# EAGLE design Adafruit GPIO Expander Bonnet Rev C (EAGLE 9.6.2)
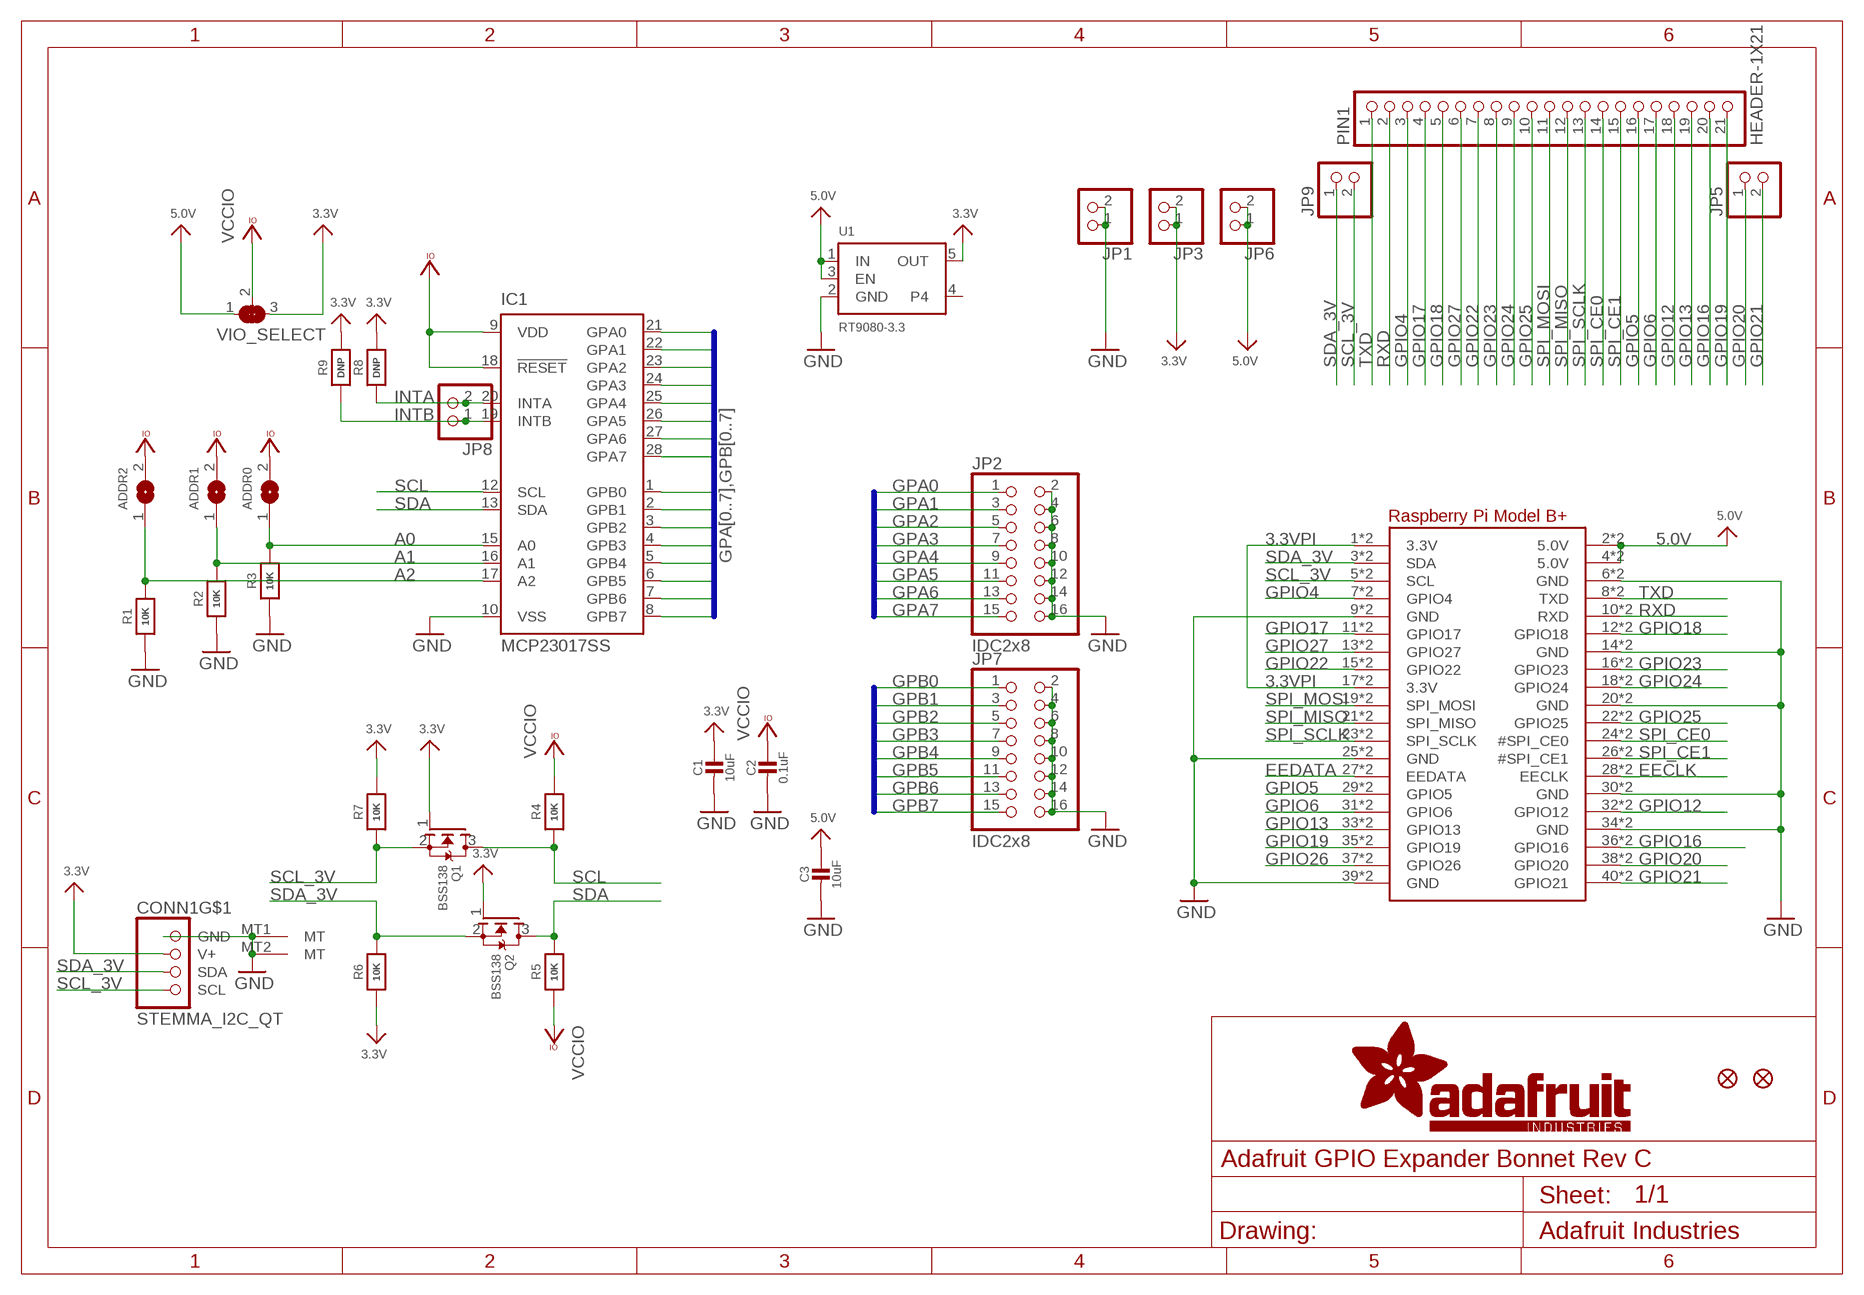
[diagram p0: schematic, sheet 1]

## Parts
ADDR0  SOLDERJUMPER  [SOLDERJUMPER_ARROW_NOPASTE]
ADDR1  SOLDERJUMPER  [SOLDERJUMPER_ARROW_NOPASTE]
ADDR2  SOLDERJUMPER  [SOLDERJUMPER_ARROW_NOPASTE]
C1  10uF  CAP_CERAMIC0805-NOOUTLINE  [0805-NO]
C2  0.1uF  CAP_CERAMIC0603_NO  [0603-NO]
C3  10uF  CAP_CERAMIC0805-NOOUTLINE  [0805-NO]
CONN1  STEMMA_I2C_QT  [JST_SH4]
FID1  FIDUCIAL_1MM  [FIDUCIAL_1MM]
FID2  FIDUCIAL_1MM  [FIDUCIAL_1MM]
IC1  MCP23017SS  [SSOP28]
JP1  HEADER-1X2ROUND  [1X02_ROUND]
JP2  IDC2x8  HEADER-2X8_SHROUDED  [2X08_SHROUDED]
JP3  HEADER-1X2ROUND  [1X02_ROUND]
JP5  HEADER-1X2ROUND  [1X02_ROUND]
JP6  HEADER-1X2ROUND  [1X02_ROUND]
JP7  IDC2x8  HEADER-2X8_SHROUDED  [2X08_SHROUDED]
JP8  HEADER-1X2ROUND  [1X02_ROUND]
JP9  HEADER-1X2ROUND  [1X02_ROUND]
PIN1  HEADER-1X21  [1X21_ROUND_70MIL]
Q1  BSS138  MOSFET-NWIDE  [SOT23-WIDE]
Q2  BSS138  MOSFET-NWIDE  [SOT23-WIDE]
R1  10K  RESISTOR_0603_NOOUT  [0603-NO]
R2  10K  RESISTOR_0603_NOOUT  [0603-NO]
R3  10K  RESISTOR_0603_NOOUT  [0603-NO]
R4  10K  RESISTOR_0603_NOOUT  [0603-NO]
R5  10K  RESISTOR_0603_NOOUT  [0603-NO]
R6  10K  RESISTOR_0603_NOOUT  [0603-NO]
R7  10K  RESISTOR_0603_NOOUT  [0603-NO]
R8  DNP  RESISTOR_0603_NOOUT  [0603-NO]
R9  DNP  RESISTOR_0603_NOOUT  [0603-NO]
RPI1  RASPBERRYPI_BPLUS_BONNET_THMSMT  [PI_BONNET_THMSMT]
U1  RT9080-3.3  VREG_SOT23-5  [SOT23-5]
VIO_SELECT  SOLDERJUMPER_2WAY  [SOLDERJUMPER_2WAY_OPEN_NOPASTE]

## Nets
3.3V: C1.1 CONN1.2(V+) JP3.1 JP3.2 Q1.1(G) Q2.1(G) R6.1 R7.2 R8.2 R9.2 U1.5(OUT) VIO_SELECT.3
3.3VPI: RPI1.1(3.3V) RPI1.17(3.3V) RPI1.S1(3.3V) RPI1.S17(3.3V)
5.0V: C3.1 JP6.1 JP6.2 RPI1.2(5.0V) RPI1.4(5.0V) RPI1.S2(5.0V) RPI1.S4(5.0V) U1.1(IN) U1.3(EN) VIO_SELECT.1
A0: ADDR0.1 IC1.15(A0) R3.2
A1: ADDR1.1 IC1.16(A1) R2.2
A2: ADDR2.1 IC1.17(A2) R1.2
EECLK: RPI1.28(EECLK) RPI1.S28(EECLK)
EEDATA: RPI1.27(EEDATA) RPI1.S27(EEDATA)
GND: C1.2 C2.2 C3.2 CONN1.1(GND) CONN1.MT1(MT) CONN1.MT2(MT) IC1.10(VSS) JP1.1 JP1.2 JP2.2 JP2.4 JP2.6 JP2.8 JP2.10 JP2.12 JP2.14 JP2.16 JP7.2 JP7.4 JP7.6 JP7.8 JP7.10 JP7.12 JP7.14 JP7.16 R1.1 R2.1 R3.1 RPI1.6(GND) RPI1.9(GND) RPI1.14(GND) RPI1.20(GND) RPI1.25(GND) RPI1.30(GND) RPI1.34(GND) RPI1.39(GND) RPI1.S6(GND) RPI1.S9(GND) RPI1.S14(GND) RPI1.S20(GND) RPI1.S25(GND) RPI1.S30(GND) RPI1.S34(GND) RPI1.S39(GND) U1.2(GND)
GPA0: IC1.21(GPA0) JP2.1
GPA1: IC1.22(GPA1) JP2.3
GPA2: IC1.23(GPA2) JP2.5
GPA3: IC1.24(GPA3) JP2.7
GPA4: IC1.25(GPA4) JP2.9
GPA5: IC1.26(GPA5) JP2.11
GPA6: IC1.27(GPA6) JP2.13
GPA7: IC1.28(GPA7) JP2.15
GPB0: IC1.1(GPB0) JP7.1
GPB1: IC1.2(GPB1) JP7.3
GPB2: IC1.3(GPB2) JP7.5
GPB3: IC1.4(GPB3) JP7.7
GPB4: IC1.5(GPB4) JP7.9
GPB5: IC1.6(GPB5) JP7.11
GPB6: IC1.7(GPB6) JP7.13
GPB7: IC1.8(GPB7) JP7.15
GPIO4: PIN1.3 RPI1.7(GPIO4) RPI1.S7(GPIO4)
GPIO5: PIN1.16 RPI1.29(GPIO5) RPI1.S29(GPIO5)
GPIO6: PIN1.17 RPI1.31(GPIO6) RPI1.S31(GPIO6)
GPIO12: PIN1.18 RPI1.32(GPIO12) RPI1.S32(GPIO12)
GPIO13: PIN1.19 RPI1.33(GPIO13) RPI1.S33(GPIO13)
GPIO16: PIN1.20 RPI1.36(GPIO16) RPI1.S36(GPIO16)
GPIO17: PIN1.4 RPI1.11(GPIO17) RPI1.S11(GPIO17)
GPIO18: PIN1.5 RPI1.12(GPIO18) RPI1.S12(GPIO18)
GPIO19: PIN1.21 RPI1.35(GPIO19) RPI1.S35(GPIO19)
GPIO20: JP5.1 RPI1.38(GPIO20) RPI1.S38(GPIO20)
GPIO21: JP5.2 RPI1.40(GPIO21) RPI1.S40(GPIO21)
GPIO22: PIN1.7 RPI1.15(GPIO22) RPI1.S15(GPIO22)
GPIO23: PIN1.8 RPI1.16(GPIO23) RPI1.S16(GPIO23)
GPIO24: PIN1.9 RPI1.18(GPIO24) RPI1.S18(GPIO24)
GPIO25: PIN1.10 RPI1.22(GPIO25) RPI1.S22(GPIO25)
GPIO26: RPI1.37(GPIO26) RPI1.S37(GPIO26)
GPIO27: PIN1.6 RPI1.13(GPIO27) RPI1.S13(GPIO27)
INTA: IC1.20(INTA) JP8.2 R8.1
INTB: IC1.19(INTB) JP8.1 R9.1
RXD: PIN1.2 RPI1.10(RXD) RPI1.S10(RXD)
SCL: IC1.12(SCL) Q1.3(D) R4.1
SCL_3V: CONN1.4(SCL) JP9.2 Q1.2(S) R7.1 RPI1.5(SCL) RPI1.S5(SCL)
SDA: IC1.13(SDA) Q2.3(D) R5.2
SDA_3V: CONN1.3(SDA) JP9.1 Q2.2(S) R6.2 RPI1.3(SDA) RPI1.S3(SDA)
SPI_CE0: PIN1.14 RPI1.24(#SPI_CE0) RPI1.S24(#SPI_CE0)
SPI_CE1: PIN1.15 RPI1.26(#SPI_CE1) RPI1.S26(#SPI_CE1)
SPI_MISO: PIN1.12 RPI1.21(SPI_MISO) RPI1.S21(SPI_MISO)
SPI_MOSI: PIN1.11 RPI1.19(SPI_MOSI) RPI1.S19(SPI_MOSI)
SPI_SCLK: PIN1.13 RPI1.23(SPI_SCLK) RPI1.S23(SPI_SCLK)
TXD: PIN1.1 RPI1.8(TXD) RPI1.S8(TXD)
VCCIO: ADDR0.2 ADDR1.2 ADDR2.2 C2.1 IC1.9(VDD) IC1.18(!RESET) R4.2 R5.1 VIO_SELECT.2
Unconnected: U1.4

## Buses
GPA[0..7],GPB[0..7]

## Library data of the parts
ADDR0 ADDR1 ADDR2 = microbuilder:SOLDERJUMPER: SMD Solder JUMPER Solder the two pads together to create a connection, or remove the solder to break it. REFLOW - Use this footprint for solder paste and reflow ovens. WAVE - Use this footprint for hand-soldering (larger pads). CLOSED - Has a trace between the two pads to ensure it is closed by default. The trace needs to be cut to disable the jumper, and can be closed again by creating a solder bridge between the two pads.; BOM: EXCLUDE
C1-C3 = microbuilder:CAP_CERAMIC: Ceramic Capacitors For new designs, use the packages preceded by an '_' character since they are more reliable: The following footprints should be used on most boards: _0402 - Standard footprint for regular board layouts _0603 - Standard footprint for regular board layouts _0805 - Standard footprint for regular board layouts _1206 - Standard footprint for regular board layouts For extremely tight-pitch boards where space is at a premium, the following 'micro-pitch' footprints can be used (smaller pads, no silkscreen outline, etc.): _0402MP - Micro-pitch footprint for very dense/compact boards _0603MP - Micro-pitch footprint for very dense/compact boards _0805MP - Micro-pitch footprint for very dense/compact boards _1206MP - Micro-pitch footprint for very dense/compact boards
CONN1 = adafruit_electromech:STEMMA_I2C; LCSC: C2845363
FID1 FID2 = microbuilder:FIDUCIAL: Fiducial Alignment Points Various fiducial points for machine vision alignment.; BOM: EXCLUDE
IC1 = microbuilder:MCP23017: http://ww1.microchip.com/downloads/en/DeviceDoc/21952a.pdf Source: http://ww1.microchip.com/downloads/en/DeviceDoc/21952a.pdf; MF: MICROCHIP; MPN: MCP23017-E/SS; OC_FARNELL: 1467674; OC_NEWARK: 31K2960
JP1 JP3 JP5 JP6 JP8 JP9 = microbuilder:HEADER-1X2: PIN HEADER
JP2 JP7 = microbuilder:HEADER-2X8
PIN1 = microbuilder:HEADER-1X21
Q1 Q2 = microbuilder:MOSFET-N: N-Channel Mosfet LEGEND VDS: Voltage Drain-Source ID: Drain Current RDS(ON): Drain-Source On-State Resistance VGS(TH): Gate-Source Threshold Voltage CISS: Drain-Source Input Capacitance SOT-23 Name VDS ID RDS(ON) VGS(TH) CISS Order Number 2N7002E 60V 260mA 2.5 Ohm 2.5V @ 250uA 26.7pF @ 25V 2N7002ET1GOSTR-ND BSH103 30V 850mA 400 mOhm 400mV @ 1mA 83pF @ 24V BSH103,235-ND BSS138 60V 320mA 1.6 Ohm 1.5V @ 250uA 50pF @ 10V Mouser: 771-BSS138PW115 DMN2075U-7 20V 4.2A 38 mOhm 1V @ 250 uA 594.3pF @ 10V DMN2075U-7DICT-ND * BSS138 good choice for I2C level-shifting POWERPAK 1212-8 Name VDS ID RDS(ON) VGS(TH) CISS Order Number Si7308DN 60V 6A 58 mOhm 3V @ 250uA 665pF @ 15V SI7308DN-T1-E3CT-ND
R1-R9 = microbuilder:RESISTOR: Resistors For new designs, use the packages preceded by an '_' character since they are more reliable: The following footprints should be used on most boards: _0402 - Standard footprint for regular board layouts _0603 - Standard footprint for regular board layouts _0805 - Standard footprint for regular board layouts _1206 - Standard footprint for regular board layouts For extremely tight-pitch boards where space is at a premium, the following 'micro-pitch' footprints can be used (smaller pads, no silkscreen outline, etc.): _0402MP - Micro-pitch footprint for very dense/compact boards _0603MP - Micro-pitch footprint for very dense/compact boards _0805MP - Micro-pitch footprint for very dense/compact boards _1206MP - Micro-pitch footprint for very dense/compact boards
RPI1 = adafruit_sbc:RASPBERRYPI_BPLUS
U1 = adafruit_power:VREG_SOT23-5: SOT23-5 Fixed Voltage Regulators Part Current Out V Out V In V Dropout θJA (°C/W) TJ (°C) Digikey Part No. ADP121 150mA 3.3V 3.4-5.5V 0.09V @ 150mA -- -- ADP121-AUJZ33R7CT-ND ADP121 150mA 3.0V 3.1-5.5V 0.09V @ 150mA -- -- ADP121-AUJZ30R7CT-ND ADP122 300mA 3.3V 3.4-5.5V 0.085V @ 300mA -- -- ADP122AUJZ-3.3-R7CT-ND ADP1712 300mA 3.3V 3.5-5.5V 0.17V @ 300mA -- -- ADP1712AUJZ-3.3-R7TR-ND AP7311 (Low Cost) 150mA 3.3V 3.5-6V 0.15V @ 150mA -- -- AP7311-33WG-7DICT-ND LD39015M18R 150mA 1.8V 1.9V-5.5V 0.08V @ 100mA -- -- 497-6977-1-ND LP2985A-33DBVR 150mA 3.3V 3.3-16V 0.28V @ 150mA 206 150 296-18479-1-ND MCP1824T-3302E/OT 300mA 3.3V 3.5V-6V 0.2V @ 300mA -- -- MCP1824T-3302E/OTCT-ND MIC5205-2.5YM5 TR 150mA 2.5V 2.7-16V 0.165V @ 150mA -- -- 576-1257-2-ND MIC5205-3.0YM5 TR 150mA 3.0V 3.2V-16V 0.165V @ 150mA -- -- 576-1258-2-ND MIC5205-3.3YM5 TR 150mA 3.3V 3.5V-16V 0.165V @ 150mA -- -- 576-1259-2-ND TPS780330220 150mA 3.3V+2.2V 3.6-5.5V 250mV Max -- -- 296-23332-1-ND TDA3663/N1,135 100mA 3.3V 3.5-45V 0.18V @ 50mA -- -- 568-5343-1-ND Max operating temp can be calculated using θJA, TJ (max junction temperature), and power in watts. Set the "Maximum Ambient Temperature" until it reaches TJ ("Max Junction Temperature"), which is the absolute limit for safe use of the regulator: Heat Sink Temperature Calculator <http://www.daycounter.com/Calculators/Heat-Sink-Temperature-Calculator.phtml> For example, With 12V source into a 3.3V LP2985 and a 30mA load, we are dissipating (12V-3.3V) * 0.03A = 0.261W. With a θJA of 206 °C/W, a TJ of 150°C, and 261mW we can safely use the chip without a heat sink up to 75°C (=147.1°C Junction Temperature).; JLC_ROTATION: 0
VIO_SELECT = microbuilder:SOLDERJUMPER_2WAY: 2-Way Solder Jumper

## Board
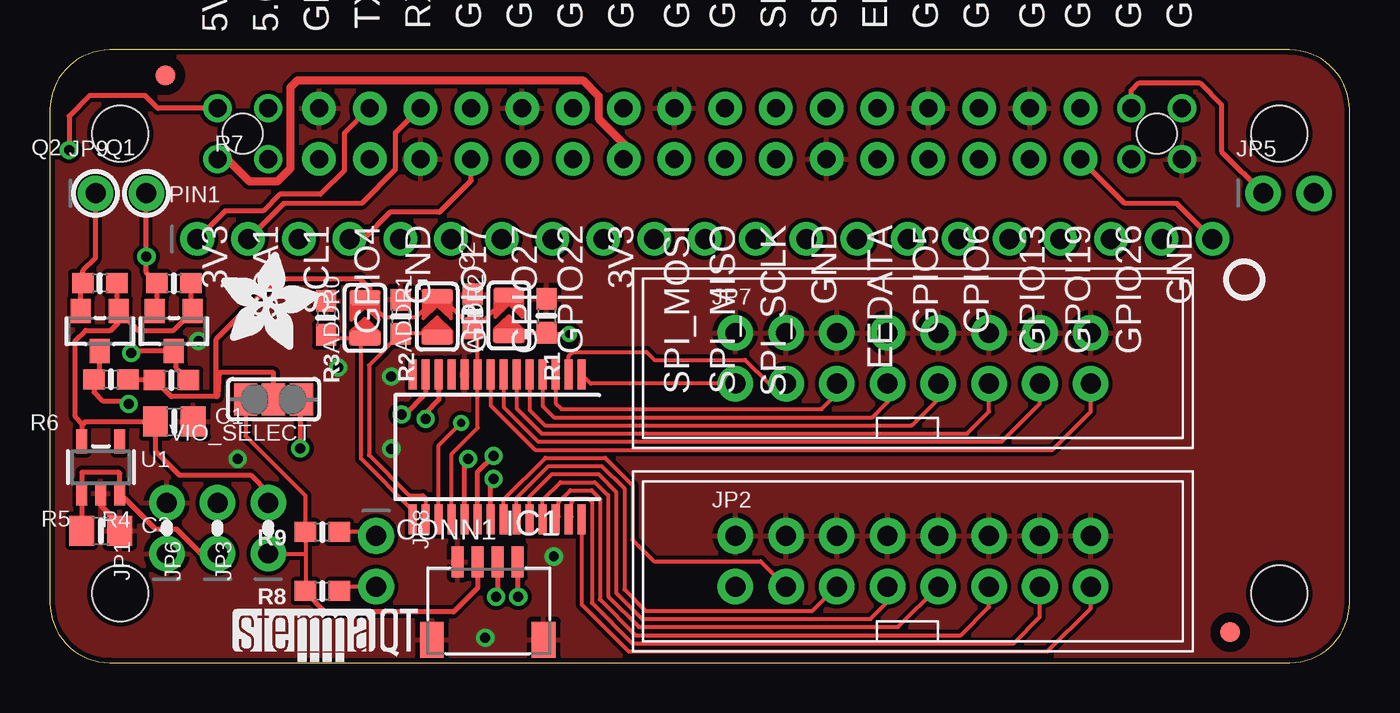
[diagram p1: board, top side]
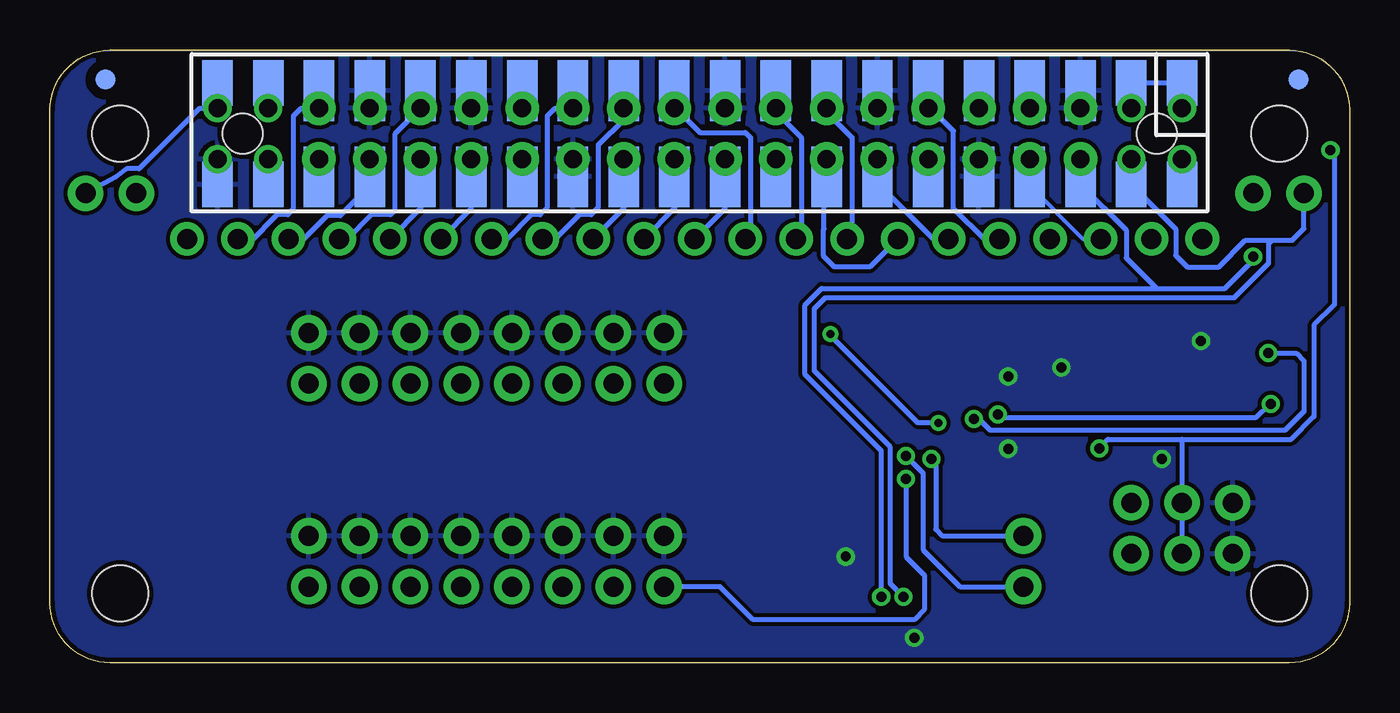
[diagram p2: board, bottom side, seen from below]

Size 65.02 x 30.67 mm. Coordinates in mm from the lower left corner, seen from the top.
Outline: 0,27.67 0,3 arc90 3,0 62.02,0 arc90 65.02,3 65.02,27.67 arc90 62.02,30.67 3,30.67 arc90 0,27.67
Copper layers (1*16): Top 0.035mm / dielectric 1.5mm / Bottom 0.035mm
Design rules "adafruit *": minimum track width 8mil, minimum drill 15.5mil, track to track 8mil, track to pad 8mil, pad to pad 8mil, via to via 8mil, smd to smd 8mil, copper to edge 10mil, drill to drill 8mil, minimum pad ring 10mil, minimum via ring 8mil, stop-mask expansion 2mil, vias tented up to drill 20mil, thermal gap 10mil

### Footprints (pad centres in the part's own frame; a part is rotated, then mirrored left to right if it is on the bottom)
SOLDERJUMPER_ARROW_NOPASTE = smd 0.762 x 1.524: 1 -1.016,0; 2 1.016,0
0805-NO = smd 1.24 x 1.5: 1 -0.95,0; 2 0.95,0
0603-NO = smd 1.075 x 1: 1 -0.85,0; 2 0.85,0
JST_SH4 = smd 0.6 x 1.55: 1 -1.5,2.006; 2 -0.5,2.006; 3 0.5,2.006; 4 1.5,2.006 | smd 1.2 x 1.8: MT1 -2.8,-1.894; MT2 2.8,-1.894
FIDUCIAL_1MM = smd 1 x 1: 1 0,0
SSOP28 = smd 0.4 x 1.5: 1 -4.225,-3.625; 2 -3.575,-3.625; 3 -2.925,-3.625; 4 -2.275,-3.625; 5 -1.625,-3.625; 6 -0.975,-3.625; 7 -0.325,-3.625; 8 0.325,-3.625; 9 0.975,-3.625; 10 1.625,-3.625; 11 2.275,-3.625; 12 2.925,-3.625; 13 3.575,-3.625; 14 4.225,-3.625; 15 4.225,3.625; 16 3.575,3.625; 17 2.925,3.625; 18 2.275,3.625; 19 1.625,3.625; 20 0.975,3.625; 21 0.325,3.625; 22 -0.325,3.625; 23 -0.975,3.625; 24 -1.625,3.625; 25 -2.275,3.625; 26 -2.925,3.625; 27 -3.575,3.625; 28 -4.225,3.625
1X02_ROUND = drill 1 pad 1.778: 1 -1.27,0; 2 1.27,0
2X08_SHROUDED = drill 1 pad 1.778: 1 -8.89,-1.27; 2 -8.89,1.27; 3 -6.35,-1.27; 4 -6.35,1.27; 5 -3.81,-1.27; 6 -3.81,1.27; 7 -1.27,-1.27; 8 -1.27,1.27; 9 1.27,-1.27; 10 1.27,1.27; 11 3.81,-1.27; 12 3.81,1.27; 13 6.35,-1.27; 14 6.35,1.27; 15 8.89,-1.27; 16 8.89,1.27
1X21_ROUND_70MIL = drill 1 pad 1.676: 1 -25.4,0; 2 -22.86,0; 3 -20.32,0; 4 -17.78,0; 5 -15.24,0; 6 -12.7,0; 7 -10.16,0; 8 -7.62,0; 9 -5.08,0; 10 -2.54,0; 11 0,0; 12 2.54,0; 13 5.08,0; 14 7.62,0; 15 10.16,0; 16 12.7,0; 17 15.24,0; 18 17.78,0; 19 20.32,0; 20 22.86,0; 21 25.4,0
SOT23-WIDE = smd 1 x 1.2: 1 -0.95,-1; 2 0.95,-1; 3 0,1
PI_BONNET_THMSMT = drill 0.9 pad 1.27: 1 -24.13,-1.27; 2 -24.13,1.27; 3 -21.59,-1.27; 4 -21.59,1.27; 37 21.59,-1.27; 38 21.59,1.27; 39 24.13,-1.27; 40 24.13,1.27 | drill 0.9 pad 1.676: 5 -19.05,-1.27; 6 -19.05,1.27; 7 -16.51,-1.27; 8 -16.51,1.27; 9 -13.97,-1.27; 10 -13.97,1.27; 11 -11.43,-1.27; 12 -11.43,1.27; 13 -8.89,-1.27; 14 -8.89,1.27; 15 -6.35,-1.27; 16 -6.35,1.27; 17 -3.81,-1.27; 18 -3.81,1.27; 19 -1.27,-1.27; 20 -1.27,1.27; 21 1.27,-1.27; 22 1.27,1.27; 23 3.81,-1.27; 24 3.81,1.27; 25 6.35,-1.27; 26 6.35,1.27; 27 8.89,-1.27; 28 8.89,1.27; 29 11.43,-1.27; 30 11.43,1.27; 31 13.97,-1.27; 32 13.97,1.27; 33 16.51,-1.27; 34 16.51,1.27; 35 19.05,-1.27; 36 19.05,1.27 | smd 1 x 1 bottom: 41 -29.96,2.71; 42 29.73,2.71 | smd 1.524 x 2.286 bottom: S1 -24.13,-2.542; S2 -24.13,2.538; S3 -21.59,-2.542; S4 -21.59,2.538; S37 21.59,-2.542; S38 21.59,2.538; S39 24.13,-2.542; S40 24.13,2.538 | smd 1.524 x 2.54 bottom: S5 -19.05,-2.415 | smd 1.524 x 3.048 bottom: S6 -19.05,2.157; S7 -16.51,-2.161; S8 -16.51,2.157; S9 -13.97,-2.161; S10 -13.97,2.157; S11 -11.43,-2.161; S12 -11.43,2.157; S13 -8.89,-2.161; S14 -8.89,2.157; S15 -6.35,-2.161; S16 -6.35,2.157; S17 -3.81,-2.161; S18 -3.81,2.157; S19 -1.27,-2.161; S20 -1.27,2.157; S21 1.27,-2.161; S22 1.27,2.157; S23 3.81,-2.161; S24 3.81,2.157; S25 6.35,-2.161; S26 6.35,2.157; S27 8.89,-2.161; S28 8.89,2.157; S29 11.43,-2.161; S30 11.43,2.157; S31 13.97,-2.161; S32 13.97,2.157; S33 16.51,-2.161; S34 16.51,2.157; S35 19.05,-2.161; S36 19.05,2.157 | hole 2.8: -29,0; 29,0; 29,-23; -29,-23 | hole 2: -22.86,0; 22.86,0
SOT23-5 = smd 0.55 x 1.2: 1 -0.95,-1.3; 2 0,-1.3; 3 0.95,-1.3; 4 0.95,1.3; 5 -0.95,1.3
SOLDERJUMPER_2WAY_OPEN_NOPASTE = smd 1.168 x 1.6: 1 -1.397,0; 2 0,0; 3 1.397,0

### Placement (x,y rotation side)
ADDR0  15.77,17.25 90 top
ADDR1  19.38,17.32 90 top
ADDR2  22.96,17.38 90 top
C1  6.22,12.06 0 top
C2  21.15,17.59 90 top
C3  2.54,6.6 0 top
CONN1  21.91,3.05 0 top
FID1  5.78,29.4 0 top
FID2  59.05,1.52 0 top
IC1  22.38,10.79 180 top
JP1  5.84,6.73 90 top
JP2  43.18,5.08 0 top
JP3  10.92,6.73 90 top
JP5  61.98,23.5 0 top
JP6  8.38,6.73 90 top
JP7  43.18,15.24 0 top
JP8  16.32,5.08 270 top
JP9  3.56,23.5 0 top
PIN1  32.77,21.21 0 top
PLABEL0  [PLABEL0]  5.84,9.65 0 top
PLABEL1  [PLABEL1]  8.38,9.65 0 top
PLABEL2  [PLABEL2]  11.05,9.59 0 top
PLABEL3  [PLABEL3]  2.13,21.54 0 top
PLABEL4  [PLABEL4]  5.16,21.46 0 top
PLABEL5  [PLABEL5]  7.37,22.86 0 top
PLABEL6  [PLABEL6]  9.91,22.86 0 top
PLABEL7  [PLABEL7]  12.45,22.86 0 top
PLABEL8  [PLABEL8]  14.99,22.86 0 top
PLABEL9  [PLABEL9]  17.53,22.86 0 top
PLABEL10  [PLABEL10]  20.07,22.86 0 top
PLABEL11  [PLABEL11]  22.61,22.86 0 top
PLABEL12  [PLABEL12]  25.15,22.86 0 top
PLABEL13  [PLABEL13]  27.69,22.86 0 top
PLABEL14  [PLABEL14]  30.23,22.86 0 top
PLABEL15  [PLABEL15]  32.77,22.86 0 top
PLABEL16  [PLABEL16]  35.31,22.86 0 top
PLABEL17  [PLABEL17]  37.85,22.86 0 top
PLABEL18  [PLABEL18]  40.39,22.86 0 top
PLABEL19  [PLABEL19]  42.93,22.86 0 top
PLABEL20  [PLABEL20]  45.47,22.86 0 top
PLABEL21  [PLABEL21]  48.01,22.86 0 top
PLABEL22  [PLABEL22]  50.55,22.86 0 top
PLABEL23  [PLABEL23]  53.09,22.86 0 top
PLABEL24  [PLABEL24]  55.63,22.86 0 top
PLABEL25  [PLABEL25]  58.17,22.86 0 top
PLABEL26  [PLABEL26]  60.71,21.72 0 top
PLABEL27  [PLABEL27]  63.25,21.72 0 top
PLABEL28  [PLABEL28]  23.05,19.68 0 top
PLABEL29  [PLABEL29]  19.49,19.68 0 top
PLABEL30  [PLABEL30]  15.62,19.68 0 top
PLABEL31  [PLABEL31]  11.3,15.05 0 top
PLABEL32  [PLABEL32]  12.7,11.37 0 top
PLABEL33  [PLABEL33]  13.84,5.21 0 top
PLABEL34  [PLABEL34]  13.84,8 0 top
PLABEL35  [PLABEL35]  59.18,16.76 0 top
PLABEL36  [PLABEL36]  59.31,6.6 0 top
PLABEL37  [PLABEL37]  28.26,7.37 90 top
PLABEL38  [PLABEL38]  28.19,17.65 90 top
PLABEL39  [PLABEL39]  28.19,12.89 90 top
PLABEL40  [PLABEL40]  28.19,2.79 90 top
PLABEL41  [PLABEL41]  58.67,3.68 0 top
PLABEL42  [PLABEL42]  58.67,13.97 0 top
PLABEL43  [PLABEL43]  52.07,12.19 0 top
PLABEL44  [PLABEL44]  46.99,12.19 0 top
PLABEL45  [PLABEL45]  49.53,12.19 0 top
PLABEL46  [PLABEL46]  44.45,12.19 0 top
PLABEL47  [PLABEL47]  41.91,12.19 0 top
PLABEL48  [PLABEL48]  39.37,12.19 0 top
PLABEL49  [PLABEL49]  36.83,12.19 0 top
PLABEL50  [PLABEL50]  34.29,12.19 0 top
PLABEL51  [PLABEL51]  52.07,2.03 0 top
PLABEL52  [PLABEL52]  46.99,2.03 0 top
PLABEL53  [PLABEL53]  49.53,2.03 0 top
PLABEL54  [PLABEL54]  44.45,2.03 0 top
PLABEL55  [PLABEL55]  41.91,2.03 0 top
PLABEL56  [PLABEL56]  39.37,2.03 0 top
PLABEL57  [PLABEL57]  36.83,2.03 0 top
PLABEL58  [PLABEL58]  34.29,2.03 0 top
PLABEL59  [PLABEL59]  31.62,4.95 0 top
PLABEL60  [PLABEL60]  31.62,15.49 0 top
PLABEL61  [PLABEL61]  63.94,13.02 90 top
PLABEL62  [PLABEL62]  62.29,12.76 90 top
PLABEL63  [PLABEL63]  9.78,11.43 0 top
Q1  6.2,16.6 180 top
Q2  2.5,16.6 180 top
R1  24.84,17.35 270 top
R2  17.55,17.32 270 top
R3  13.81,17.25 270 top
R4  6.09,14.15 180 top
R5  3.06,14.18 180 top
R6  2.5,19 180 top
R7  6.2,19 0 top
R8  13.63,3.59 180 top
R9  13.63,6.54 180 top
RPI1  32.51,26.48 0 top
U1  2.54,9.78 0 top
U$12  [ADAFRUIT_5MM]  8.57,15.68 0 top
U$13  [PCBFEAT-REV-040]  59.75,19.18 90 top
U$19  [STEMMAQT]  9.14,0.06 0 top
VIO_SELECT  11.19,13.19 180 top

### Tracks (layer width: path | path; a pad name or v marks a point on that pad's centre or on a via)
3.3V
  Top 0.203: JP3.1 12.78,5.46 R8.2 R9.2 12.78,8.35 9.79,11.35 VIO_SELECT.3
  Top 0.254: R6.1 3.35,17.7 3.41,17.64 | 3.41,17.64 Q2.1 4.41,16.64 6.19,16.64 Q1.1 7.05,17.7 R7.2 | JP3.1 JP3.2 10.92,8.51 10.03,9.4 6.48,9.4 5.27,10.6 C1.1 1.78,12.06 1.65,11.94 | 1.65,11.94 1.27,12.32 1.27,16.13 1.78,16.64 3.05,16.64 3.41,17 3.41,17.64 | U1.5 1.59,11.88 1.65,11.94 | CONN1.2 21.41,3.75 20.19,2.54 13.78,2.54 12.78,3.54 R8.2
3.3VPI
  Top 0.406: RPI1.1 8.86,25.21 9.97,24.1 11.38,24.1 12.03,24.75 12.03,28.8 12.38,29.15 26.67,29.15 27.46,28.36 27.46,27.23 28.7,25.99 RPI1.17
  Bottom 0.254: RPI1.S17 RPI1.17 | RPI1.17 | RPI1.S1 RPI1.1 | RPI1.1
5.0V  (via drill 0.5)
  Top 0.254: C3.1 U1.1 1.59,9.53 3.43,9.53 3.49,9.46 U1.3 5.29,6.68 6.35,6.68 7.57,5.46 JP6.1 | RPI1.2 5.4,27.75 4.76,28.38 1.97,28.38 0.95,27.37 v0.95,25.65 | VIO_SELECT.1 12.53,13.13 v12.53,10.73
  Bottom 0.254: 8.38,11.18 JP6.2 JP6.1 | 8.38,11.18 2.92,11.18 1.78,12.32 1.78,16.89 0.76,17.91 0.76,25.46 v0.95,25.65 | RPI1.2 | RPI1.4 RPI1.S4 RPI1.S2 RPI1.2 | RPI1.4 | v12.53,10.73 12.08,11.18 8.38,11.18
A0
  Top 0.203: ADDR0.1 15.56,16.24 | 15.56,16.24 13.98,16.24 R3.2 | IC1.15 18.16,7.62 15.56,10.22 15.56,16.24
A1
  Top 0.203: ADDR1.1 19.21,16.47 R2.2 15.96,14.88 15.96,10.39 17.97,8.38 18.67,8.38 18.8,8.24 IC1.16
A2  (via drill 0.39)
  Top 0.203: IC1.17 19.46,10.88 v20.57,12 | v25.97,16.45 24.9,16.45 R1.2 23.1,16.5 ADDR2.1
  Bottom 0.203: 25.97,16.38 v25.97,16.45
  Bottom 0.254: v20.57,12 21.59,12 25.97,16.38
EECLK
  Bottom 0.254: RPI1.S28 | RPI1.S28 RPI1.28
EEDATA
  Bottom 0.254: RPI1.S27 RPI1.27 | RPI1.27
GND  (via drill 0.5)
  Top 0.254: U1.2 2.54,7.87 3.49,6.92 C3.2
  other vias: 7.43,16.11 14.41,14.77 9.4,10.2 17.08,10.71 17.08,14.33 21.78,1.25 25.21,5.31
  pour Bottom: 0,30.99 64.77,30.99 64.77,0 0,0
  pour Top: 0,30.99 64.77,30.99 64.77,0 0,0
GPA0  (via drill 0.5)
  Top 0.254: IC1.21 22.05,9.07 v22.19,9.21
  Bottom 0.254: v22.19,9.21 22.19,5.3 21.27,4.38 21.27,2.67 21.78,2.16 29.84,2.16 31.5,3.81 JP2.1
GPA1
  Top 0.203: IC1.22 22.71,8.17 24.79,10.25 27.77,10.25 29.14,8.88 29.14,6.16 30.22,5.08 35.56,5.08 JP2.3
GPA2
  Top 0.203: IC1.23 23.36,8.25 24.96,9.85 27.61,9.85 28.74,8.72 28.74,3.67 29.8,2.6 38.16,2.6 JP2.5
GPA3
  Top 0.203: IC1.24 24.01,8.32 25.12,9.44 27.44,9.44 28.33,8.55 28.33,3.5 29.63,2.2 41.06,2.2 41.91,3.05 JP2.7
GPA4
  Top 0.203: IC1.25 24.66,8.15 25.54,9.03 27.27,9.03 27.92,8.38 27.92,3.33 29.46,1.79 42.43,1.79 JP2.9
GPA5
  Top 0.203: IC1.26 25.45,7.31 25.45,8.04 26.04,8.63 27.1,8.63 27.52,8.21 27.52,3.16 29.29,1.38 45.58,1.38 46.99,2.79 JP2.11
GPA6
  Top 0.203: IC1.27 26.1,7.31 26.1,8.04 26.28,8.22 26.93,8.22 27.11,8.04 27.11,2.99 29.12,0.98 48.22,0.98 49.53,2.29 JP2.13
GPA7
  Top 0.203: IC1.28 26.61,2.92 28.96,0.57 49.91,0.57 52.07,2.73 JP2.15
GPB0
  Top 0.203: JP7.1 27.05,13.97 IC1.1
GPB1
  Top 0.203: IC1.2 25.96,15.35 26.16,15.56 29.84,15.56 30.24,15.16 34.78,15.16 35.98,13.97 JP7.3
GPB2
  Top 0.203: IC1.3 25.3,12.98 25.59,12.69 38.61,12.69 39.37,13.45 JP7.5
GPB3
  Top 0.203: IC1.4 24.66,12.84 25.21,12.29 41.15,12.29 41.91,13.05 JP7.7
GPB4
  Top 0.203: IC1.5 24.01,12.64 24.77,11.88 43.12,11.88 44.45,13.21 JP7.9
GPB5
  Top 0.203: IC1.6 23.36,12.72 24.6,11.47 45.89,11.47 46.99,12.57 JP7.11
GPB6
  Top 0.203: IC1.7 22.71,12.79 24.43,11.07 47.62,11.07 49.53,12.97 JP7.13
GPB7
  Top 0.203: IC1.8 22.05,12.87 24.27,10.66 50.16,10.66 52.07,12.57 JP7.15
GPIO4
  Bottom 0.203: PIN1.3 13.34,21.21 16,23.88 RPI1.S7 RPI1.7 | RPI1.7
GPIO5
  Bottom 0.254: PIN1.16 43.93,22.75 43.94,22.76 RPI1.S29 RPI1.29 | RPI1.29
GPIO6
  Bottom 0.254: PIN1.17 46.47,22.75 46.48,22.76 RPI1.S31 RPI1.31 | RPI1.31
GPIO12
  Bottom 0.254: PIN1.18 50.16,21.21 48.95,22.42 47.98,22.42 47.75,22.65 47.75,26.48 RPI1.32 RPI1.S32 | RPI1.S32
GPIO13
  Bottom 0.254: PIN1.19 52.33,21.21 51.16,22.38 50.51,22.38 48.82,24.06 49.02,24.27 RPI1.S33 RPI1.33 | RPI1.33
GPIO16
  Bottom 0.254: PIN1.20 55.5,21.08 54.99,21.08 53.65,22.42 53.13,22.42 52.83,22.72 52.83,27.38 52.46,27.75 RPI1.36 RPI1.S36 | RPI1.S36
GPIO17
  Top 0.254: PIN1.4 15.68,21.21 17.02,22.54 19.49,22.54 21.08,24.13 RPI1.11
  Bottom 0.203: RPI1.S11 | RPI1.S11 RPI1.11
GPIO18
  Bottom 0.254: PIN1.5 18.28,21.21 19.81,22.74 19.81,26.61 21.08,27.88 | RPI1.S12 | RPI1.S12 21.08,27.88 | 21.08,27.88 RPI1.12
GPIO19
  Top 0.254: PIN1.21 56.39,22.99 53.78,22.99 RPI1.35
  Bottom 0.254: RPI1.S35 RPI1.35 | RPI1.35
GPIO20
  Top 0.254: RPI1.38 54.1,28.64 54.48,29.02 57.53,29.02 58.61,27.94 58.61,25.59 JP5.1
  Bottom 0.254: RPI1.S38 54.1,28.45 | RPI1.38 54.1,28.45 | 54.1,28.45
GPIO21
  Bottom 0.254: RPI1.S40 RPI1.40 57.53,27.75 60.56,24.72 61.2,24.72 61.72,24.32 JP5.2
GPIO22
  Bottom 0.254: PIN1.7 24,19.81 25.78,19.81 26.31,20.34 26.31,21.69 26.29,21.72 26.29,23.5 26.67,23.88 26.38,24.16 26.23,24.32 RPI1.S15 RPI1.15 | RPI1.15
GPIO23
  Bottom 0.254: PIN1.8 24.89,21.46 24.89,26.29 26.16,27.56 RPI1.S16 | RPI1.S16 | RPI1.S16 RPI1.16
GPIO24
  Bottom 0.254: PIN1.9 27.43,21.46 27.43,26.29 28.7,27.56 RPI1.S18 | RPI1.S18 | RPI1.S18 RPI1.18
GPIO25
  Bottom 0.254: PIN1.10 29.97,21.46 29.97,26.29 30.23,26.54 32.51,26.54 33.4,27.43 33.77,27.8 33.78,27.81 RPI1.S22 RPI1.22 | RPI1.22
GPIO26
  Bottom 0.254: RPI1.S37 RPI1.37 | RPI1.37
GPIO27
  Bottom 0.254: PIN1.6 20.83,21.21 23.4,23.78 23.61,23.99 23.62,24 RPI1.S13 RPI1.13 | RPI1.13
INTA  (via drill 0.5)
  Top 0.203: JP8.2 14.7,3.81 R8.1
  Top 0.254: IC1.20 21.41,9.56 v22.19,10.35
  Bottom 0.254: v22.19,10.35 21.34,9.5 21.34,5.65 19.49,3.81 JP8.2
INTB  (via drill 0.5)
  Top 0.203: JP8.1 16.13,6.54 R9.1
  Top 0.254: IC1.19 20.76,10.02 v20.92,10.19
  Bottom 0.254: v20.92,10.19 20.7,9.97 20.7,6.67 20.38,6.35 JP8.1
N$1
  Top 0.254: 11.68,13.21 12.19,13.21
RXD
  Top 0.254: PIN1.2 11.68,22.99 15.59,22.99 17.27,24.67 17.27,26.51 18.51,27.75 RPI1.10
  Bottom 0.254: RPI1.S10 RPI1.10 | RPI1.10
SCL  (via drill 0.5)
  Top 0.254: R4.1 6.3,14.79 6.3,15.5 Q1.3 4.17,15.6 v4.06,15.49 | IC1.12 19.46,13.17 18.8,12.51 v18.8,12.19
  Bottom 0.254: v4.06,15.49 2.67,15.49 2.29,15.11 2.29,12.57 3.22,11.64 17.99,11.64 18.54,12.19 v18.8,12.19
SCL_3V  (via drill 0.5)
  Top 0.254: Q1.2 5.35,17.7 R7.1 4.83,19.52 v4.83,20.32 JP9.2 | CONN1.4 23.41,3.33 v23.43,3.3
  Bottom 0.254: RPI1.5 RPI1.S5 13.46,23.94 11.18,21.65 11.18,20.26 9.65,18.73 | RPI1.5 | v4.83,20.32 4.83,20.14 6.24,18.73 9.65,18.73 | v23.43,3.3 23.43,10.6 27.24,14.41 27.24,17.91 26.42,18.73 9.65,18.73
SDA  (via drill 0.5)
  Top 0.254: v3.94,12.95 3.81,13.08 2.67,13.08 2.21,13.54 R5.2 2.5,14.48 Q2.3 | IC1.13 18.8,13.47 17.69,12.36 17.65,12.36 v17.59,12.42
  Bottom 0.254: v3.94,12.95 4,12.95 4.68,12.28 17.59,12.28 v17.59,12.42
SDA_3V  (via drill 0.5)
  Top 0.254: Q2.2 1.55,18.9 R6.2 1.65,19.62 2.29,20.26 JP9.1 | CONN1.3 22.41,3.39 v22.32,3.3
  Bottom 0.254: RPI1.3 RPI1.S3 8.7,21.72 8.7,20.38 8.13,19.81 6.54,19.81 5.21,21.14 3.87,21.14 | RPI1.3 | 3.87,21.14 2.86,21.14 2.29,21.72 JP9.1 | v22.32,3.3 22.97,3.95 22.97,10.79 26.78,14.6 26.78,17.72 26.23,18.27 5.76,18.27 4.04,20 4.04,20.98 3.87,21.14
SPI_CE0
  Bottom 0.254: PIN1.14 39.75,21.21 38.54,22.42 37.95,22.42 37.59,22.78 37.59,25.91 36.31,27.19 36.32,27.2 RPI1.S24 RPI1.24 | RPI1.24
SPI_CE1
  Bottom 0.254: PIN1.15 42.16,21.21 40.95,22.42 40.49,22.42 40.13,22.78 40.13,27.38 39.76,27.75 RPI1.26 RPI1.S26 | RPI1.S26
SPI_MISO
  Bottom 0.254: PIN1.12 33.77,22.75 33.78,22.76 RPI1.S21 RPI1.21 | RPI1.21
SPI_MOSI
  Bottom 0.254: PIN1.11 31.23,22.75 31.23,23.67 31.24,23.69 RPI1.S19 | RPI1.S19 | RPI1.S19 RPI1.19 | RPI1.19
SPI_SCLK
  Bottom 0.254: PIN1.13 36.31,22.75 36.32,22.76 RPI1.S23 36.32,23.62 | 36.32,23.62 | 36.32,23.62 RPI1.23
TXD
  Top 0.254: PIN1.1 8.76,22.61 10.66,22.61 11.49,23.44 13.54,23.44 14.73,24.64 14.73,26.51 15.97,27.75 RPI1.8
  Bottom 0.254: RPI1.S8 RPI1.8 | RPI1.8
VCCIO
  Top 0.203: C2.1 21.41,16.48 IC1.9 21.41,11.75 20.11,10.45 IC1.18 | C2.1 21.3,16.74 ADDR2.2 | C2.1 19.55,18.33 ADDR1.2 18.35,17.31 16.73,17.31 16,18.03 ADDR0.2
  Top 0.254: R5.1 5.2,14.18 R4.2 6.07,13.32 8.32,13.32 | VIO_SELECT.2 11.19,14.52 8.48,14.52 8.38,13.32 8.32,13.32 | 8.32,13.32 8.32,16.19 11.37,19.24 15.49,19.24 16,18.73 16,18.03

### Text on the board
Pinguin_tBackup: TX | RX | 4 | 17 | 18 | 27 | 22 | 23 | 24 | 25 | MOS | MIS | CLK | CE0 | CE1 | 5 | 6 | 12 | 13 | 16 | 19 | SDA | 20 | 21 | SCL | A0 | A1 | A2 | GND | GND | Vio | B | B7 | GPB0 | MCP23017 GPIO | 0 | 1 | 2 | 3 | 4 | 5 | 6 | 7 | Expander Bonnet | 3V | 5V | G | 5V | 3V | INTB | GND | GND | INTA | A | GPA0 | A7 | 0 | 1 | 2 | 3 | 4 | 5 | 6 | 7